# EAGLE schematic custom_hat_v_alpha (EAGLE 9.6.2)
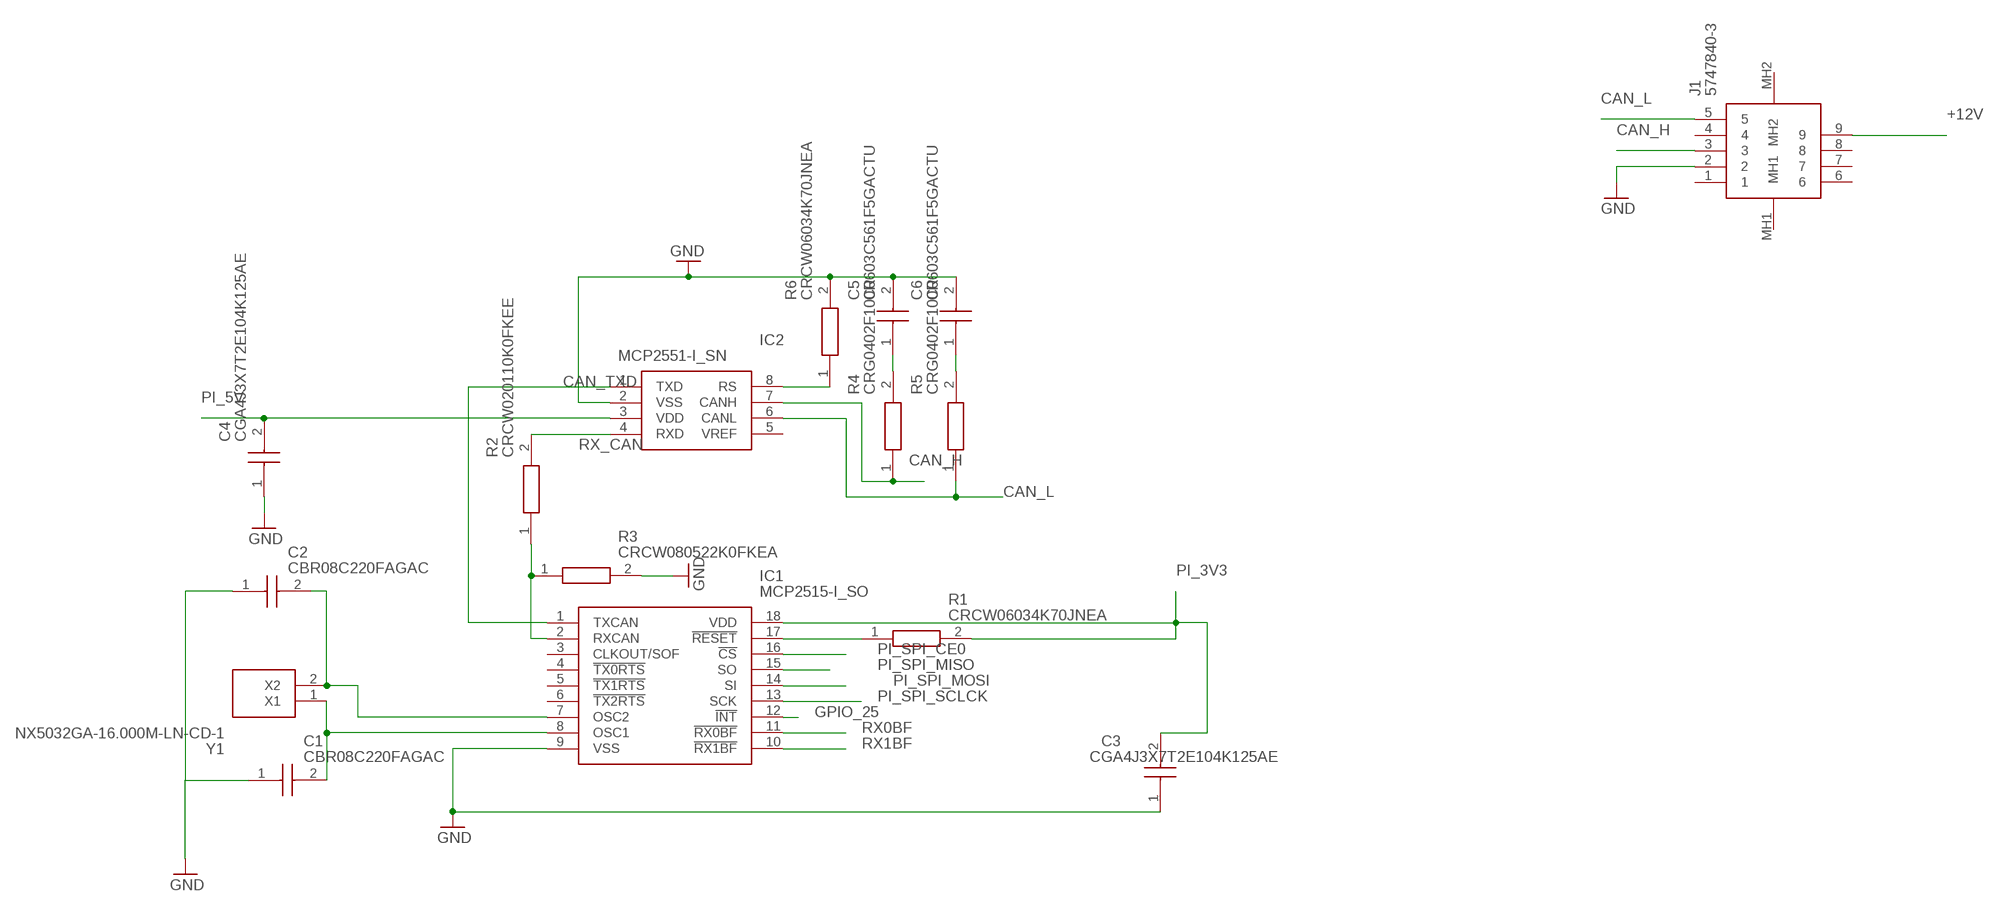
[diagram p0: schematic, sheet 1]

## Parts
C1  CBR08C220FAGAC  [CAPC2012X95N]
C2  CBR08C220FAGAC  [CAPC2012X95N]
C3  CGA4J3X7T2E104K125AE  [CAPC2012X145N]
C4  CGA4J3X7T2E104K125AE  [CAPC2012X145N]
C5  C0603C561F5GACTU  [CAPC1608X87N]
C6  C0603C561F5GACTU  [CAPC1608X87N]
IC1  MCP2515-I_SO  [SOIC127P1030X265-18N]
IC2  MCP2551-I_SN  [SOIC127P600X175-8N]
J1  5747840-3  [57478403]
R1  CRCW06034K70JNEA  [RESC1608X50N]
R2  CRCW020110K0FKEE  [RESC0603X28N]
R3  CRCW080522K0FKEA  [RESC2012X50N]
R4  CRG0402F100R  [RESC1005X40N]
R5  CRG0402F100R  [RESC1005X40N]
R6  CRCW06034K70JNEA  [RESC1608X50N]
Y1  NX5032GA-16.000M-LN-CD-1  [NX5032GA16000000MHZLNCD1]

## Nets
+12V: J1.9
CAN_H: IC2.7(CANH) J1.3 R4.1
CAN_L: IC2.6(CANL) J1.5 R5.1
CAN_TXD: IC1.1(TXCAN) IC2.1(TXD)
GND: C1.1 C2.1 C3.1 C4.1 C5.2 C6.2 IC1.9(VSS) IC2.2(VSS) J1.2 R3.2 R6.2
GPIO_25: IC1.12(!INT)
N$5: IC1.2(RXCAN) R2.1 R3.1
N$11: IC2.8(RS) R6.1
N$13: C1.2 IC1.8(OSC1) Y1.1(X1)
N$14: C2.2 IC1.7(OSC2) Y1.2(X2)
N$15: C5.1 R4.2
N$16: C6.1 R5.2
N$21: IC1.17(!RESET) R1.1
PI_3V3: C3.2 IC1.18(VDD) R1.2
PI_5V: C4.2 IC2.3(VDD)
PI_SPI_CE0: IC1.16(!CS)
PI_SPI_MISO: IC1.15(SO)
PI_SPI_MOSI: IC1.14(SI)
PI_SPI_SCLCK: IC1.13(SCK)
RX0BF: IC1.11(!RX0BF)
RX1BF: IC1.10(!RX1BF)
RX_CAN: IC2.4(RXD) R2.2
Unconnected: IC1.3(CLKOUT/SOF) IC1.4(!TX0RTS) IC1.5(!TX1RTS) IC1.6(!TX2RTS) IC2.5(VREF) J1.1 J1.4 J1.6 J1.7 J1.8 J1.MH1 J1.MH2

## Library data of the parts
C1 C2 = CBR08C220FAGAC:CBR08C220FAGAC: KEMET - CBR08C220FAGAC - Capacitor, RF, 22 pF, 250 V, HiQ-CBR Series, +/- 1%, 125 C, 0805 [2012 Metric] Source: Datasheet <https://datasheet.datasheetarchive.com/originals/distributors/Datasheets-DGA10/2407502.pdf>; DESCRIPTION: KEMET - CBR08C220FAGAC - Capacitor, RF, 22 pF, 250 V, HiQ-CBR Series, +/- 1%, 125 C, 0805 [2012 Metric]; HEIGHT: 0.95mm; MANUFACTURER_NAME: Kemet; MANUFACTURER_PART_NUMBER: CBR08C220FAGAC
C3 C4 = CGA4J3X7T2E104K125AE:CGA4J3X7T2E104K125AE: Capacitor Auto CGA 0805 250V 100nF X7T Source: Datasheet <https://datasheet.datasheetarchive.com/originals/distributors/Datasheets-DGA3/268663.pdf>; ARROW_PART_NUMBER: CGA4J3X7T2E104K125AE; ARROW_PRICE-STOCK: https://www.arrow.com/en/products/cga4j3x7t2e104k125ae/tdk?region=nac; DESCRIPTION: Capacitor Auto CGA 0805 250V 100nF X7T; HEIGHT: 1.45mm; MANUFACTURER_NAME: TDK; MANUFACTURER_PART_NUMBER: CGA4J3X7T2E104K125AE; MOUSER_PART_NUMBER: 810-CGA4J3X7T2E104KS; MOUSER_PRICE-STOCK: https://www.mouser.co.uk/ProductDetail/TDK/CGA4J3X7T2E104K125AE?qs=FxQuwy19cyCLbVWBJ25BJQ%3D%3D
C5 C6 = C0603C561F5GACTU:C0603C561F5GACTU: Multilayer Ceramic Capacitors MLCC - SMD/SMT 50volts 560pF C0G 1% Source: Datasheet <https://content.kemet.com/datasheets/KEM_C1003_C0G_SMD.pdf>; ARROW_PART_NUMBER: C0603C561F5GACTU; ARROW_PRICE-STOCK: https://www.arrow.com/en/products/c0603c561f5gactu/kemet-corporation; DESCRIPTION: Multilayer Ceramic Capacitors MLCC - SMD/SMT 50volts 560pF C0G 1%; HEIGHT: 0.87mm; MANUFACTURER_NAME: Kemet; MANUFACTURER_PART_NUMBER: C0603C561F5GACTU; MOUSER_PART_NUMBER: 80-C0603C561F5G; MOUSER_PRICE-STOCK: https://www.mouser.co.uk/ProductDetail/KEMET/C0603C561F5GACTU?qs=6dm3P68XlMDTfPQcBRhXNA%3D%3D
IC1 = MCP2515-I_SO:MCP2515-I_SO: CAN Controller SPI data filtering SO18 Source: Datasheet <https://datasheet.datasheetarchive.com/originals/distributors/Datasheets-34/DSA-675138.pdf>; ARROW_PART_NUMBER: MCP2515-I/SO; ARROW_PRICE-STOCK: https://www.arrow.com/en/products/mcp2515-iso/microchip-technology?region=nac; DESCRIPTION: CAN Controller SPI data filtering SO18; HEIGHT: 2.65mm; MANUFACTURER_NAME: Microchip; MANUFACTURER_PART_NUMBER: MCP2515-I/SO; MOUSER_PART_NUMBER: 579-MCP2515-I/SO; MOUSER_PRICE-STOCK: https://www.mouser.co.uk/ProductDetail/Microchip-Technology/MCP2515-I-SO?qs=KwArPi4cUogGDbGnphOvtQ%3D%3D
IC2 = MCP2551-I_SN:MCP2551-I_SN: High Speed CAN Transceiver,MCP2551-I/SN Source: Datasheet <https://datasheet.datasheetarchive.com/originals/distributors/Datasheets-34/DSA-674994.pdf>; ARROW_PART_NUMBER: MCP2551-I/SN; ARROW_PRICE-STOCK: https://www.arrow.com/en/products/mcp2551-isn/microchip-technology?region=nac; DESCRIPTION: High Speed CAN Transceiver,MCP2551-I/SN; HEIGHT: 1.75mm; MANUFACTURER_NAME: Microchip; MANUFACTURER_PART_NUMBER: MCP2551-I/SN; MOUSER_PART_NUMBER: 579-MCP2551-I/SN; MOUSER_PRICE-STOCK: https://www.mouser.co.uk/ProductDetail/Microchip-Technology/MCP2551-I-SN?qs=9y3LFqDLL8L5zFfqqxdOHg%3D%3D
J1 = 5747840-3:5747840-3: TE Connectivity Amplimite HD-20 Series, 9 Way Right Angle Through Hole PCB D-sub Connector Plug, 2.74mm Pitch, with Source: Datasheet <https://www.te.com/commerce/DocumentDelivery/DDEController?Action=srchrtrv&DocNm=5747840&DocType=Customer Drawing&DocLang=English>; ARROW_PART_NUMBER: 5747840-3; ARROW_PRICE-STOCK: https://www.arrow.com/en/products/5747840-3/te-connectivity?region=nac; DESCRIPTION: TE Connectivity Amplimite HD-20 Series, 9 Way Right Angle Through Hole PCB D-sub Connector Plug, 2.74mm Pitch, with; HEIGHT: 12.93mm; MANUFACTURER_NAME: TE Connectivity; MANUFACTURER_PART_NUMBER: 5747840-3; MOUSER_PART_NUMBER: 571-5747840-3; MOUSER_PRICE-STOCK: https://www.mouser.co.uk/ProductDetail/TE-Connectivity/5747840-3?qs=x6EjVpvqMVNS%252B6EaV6pwhg%3D%3D
R1 R6 = CRCW06034K70JNEA:CRCW06034K70JNEA: Vishay CRCW Series Thick Film Surface Mount Resistor 0603 Case 4.7k +/-5% 0.1W +/-200ppm/K Source: Datasheet <http://www.vishay.com/docs/20035/dcrcwe3.pdf>; ARROW_PART_NUMBER: CRCW06034K70JNEA; ARROW_PRICE-STOCK: https://www.arrow.com/en/products/crcw06034k70jnea/vishay; DESCRIPTION: Vishay CRCW Series Thick Film Surface Mount Resistor 0603 Case 4.7k +/-5% 0.1W +/-200ppm/K; HEIGHT: 0.5mm; MANUFACTURER_NAME: Vishay; MANUFACTURER_PART_NUMBER: CRCW06034K70JNEA; MOUSER_PART_NUMBER: 71-CRCW0603J-4.7K-E3; MOUSER_PRICE-STOCK: https://www.mouser.co.uk/ProductDetail/Vishay-Dale/CRCW06034K70JNEA?qs=C0xaqriB68jbLUpBrIbing%3D%3D
R2 = CRCW020110K0FKEE:CRCW020110K0FKEE: Standard Thick Film Chip Resistors value 10K0 ohm. Source: Datasheet <http://www.vishay.com/docs/20035/dcrcwe3.pdf>; ARROW_PART_NUMBER: CRCW020110K0FKEE; ARROW_PRICE-STOCK: https://www.arrow.com/en/products/crcw020110k0fkee/vishay; DESCRIPTION: Standard Thick Film Chip Resistors value 10K0 ohm.; HEIGHT: 0.28mm; MANUFACTURER_NAME: Vishay; MANUFACTURER_PART_NUMBER: CRCW020110K0FKEE
R3 = CRCW080522K0FKEA:CRCW080522K0FKEA: Vishay CRCW Series Thick Film Surface Mount Resistor 805 Case 22k +/-1% 0.125W +/-100ppm/C Source: Datasheet <http://www.vishay.com/docs/20035/dcrcwe3.pdf>; ARROW_PART_NUMBER: CRCW080522K0FKEA; ARROW_PRICE-STOCK: https://www.arrow.com/en/products/crcw080522k0fkea/vishay; DESCRIPTION: Vishay CRCW Series Thick Film Surface Mount Resistor 805 Case 22k +/-1% 0.125W +/-100ppm/C; HEIGHT: 0.5mm; MANUFACTURER_NAME: Vishay; MANUFACTURER_PART_NUMBER: CRCW080522K0FKEA; MOUSER_PART_NUMBER: 71-CRCW0805-22K-E3; MOUSER_PRICE-STOCK: https://www.mouser.co.uk/ProductDetail/Vishay-Dale/CRCW080522K0FKEA/?qs=fIsz7OpyEY835T0D7WGkRw%3D%3D
R4 R5 = CRG0402F100R:CRG0402F100R: TE Connectivity CRG0402 Series Thick Film Surface Mount Resistor 402 Case 100 +/-1% 0.063W +/-100ppm/C Source: Datasheet <https://datasheet.datasheetarchive.com/originals/distributors/DKDS-21/401698.pdf>; ARROW_PART_NUMBER: CRG0402F100R; ARROW_PRICE-STOCK: https://www.arrow.com/en/products/crg0402f100r/te-connectivity; DESCRIPTION: TE Connectivity CRG0402 Series Thick Film Surface Mount Resistor 402 Case 100 +/-1% 0.063W +/-100ppm/C; HEIGHT: 0.4mm; MANUFACTURER_NAME: TE Connectivity; MANUFACTURER_PART_NUMBER: CRG0402F100R; MOUSER_PART_NUMBER: 279-CRG0402F100R; MOUSER_PRICE-STOCK: https://www.mouser.co.uk/ProductDetail/TE-Connectivity-Holsworthy/CRG0402F100R?qs=s1WWODT2SXWUp2XB3WBFSA%3D%3D
Y1 = NX5032GA-16.000M-LN-CD-1:NX5032GA-16.000M-LN-CD-1: Crystals CRYSTAL 16MHZ 8PF SMD Source: Datasheet <https://media.digikey.com/pdf/Data Sheets/NDK PDFs/NX5032GA.pdf>; DESCRIPTION: Crystals CRYSTAL 16MHZ 8PF SMD; HEIGHT: 1.5mm; MANUFACTURER_NAME: NDK; MANUFACTURER_PART_NUMBER: NX5032GA-16.000M-LN-CD-1; MOUSER_PART_NUMBER: 344-NX5032GA16MLNCD1; MOUSER_PRICE-STOCK: https://www.mouser.co.uk/ProductDetail/NDK/NX5032GA-16000M-LN-CD-1?qs=55YtniHzbhDnyNixVDBwYw%3D%3D